# Altium schematic sheet 5V_12V_External.SchDoc
size A4; SheetNumber: 3
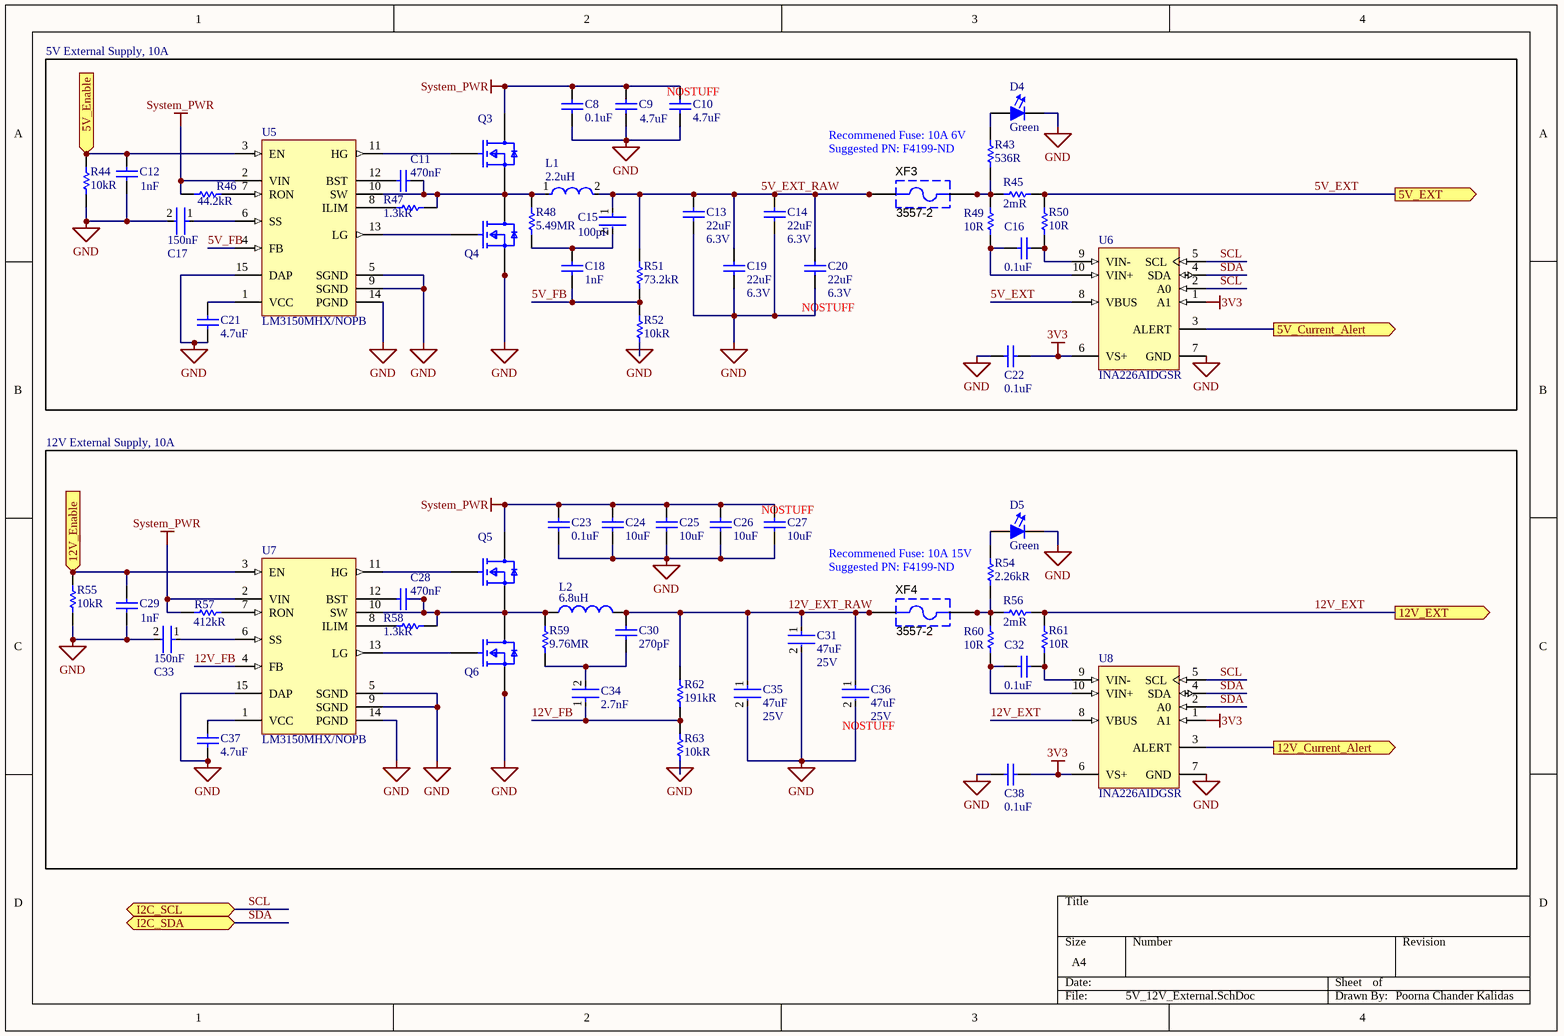
[diagram p0: 5V_12V_External.SchDoc]

## Parts
C8  Capacitance: 0.1uF  [FP-CL10-0_1-IPC_A]  (hidden comment: CL10B104JB8NNNC)
C9  Capacitance: 4.7uF  [CAPC3216X18N]  (hidden comment: CL31B475KBHNNNE)
C10  Capacitance: 4.7uF  [CAPC3216X18N]  (hidden comment: CL31B475KBHNNNE)
C11  value 470nF  [CAPC1608N(0603")]  (hidden comment: 470nF, 50V, 10%, 0603, Ceramic, SMD)
C12  Capacitance: 1nF  [CAPC1608X90X30ML10T20]  (hidden comment: CL10B102KB8NNNC)
C13  Capacitance: 22uF  Voltage Rating (DC): 6.3V  [CAPC1608X90X35ML10T15]  (hidden comment: GRM188R60J226MEA0D)
C14  Capacitance: 22uF  Voltage Rating (DC): 6.3V  [CAPC1608X90X35ML10T15]  (hidden comment: GRM188R60J226MEA0D)
C15  Capacitance: 100pF  [FP-CL10-IPC_A]  (hidden comment: CL10C101FB8NNNC)
C16  Capacitance: 0.1uF  [FP-CL10-0_1-IPC_A]  (hidden comment: CL10B104JB8NNNC)
C17  Capacitance: 150nF  [FP-CL21-IPC_A]  (hidden comment: CL21B154KBFNNNG)
C18  Capacitance: 1nF  [CAPC1608X90X30ML10T20]  (hidden comment: CL10B102KB8NNNC)
C19  Capacitance: 22uF  Voltage Rating (DC): 6.3V  [CAPC1608X90X35ML10T15]  (hidden comment: GRM188R60J226MEA0D)
C20  Capacitance: 22uF  Voltage Rating (DC): 6.3V  [CAPC1608X90X35ML10T15]  (hidden comment: GRM188R60J226MEA0D)
C21  Capacitance: 4.7uF  [CAPC3216X18N]  (hidden comment: CL31B475KBHNNNE)
C22  Capacitance: 0.1uF  [FP-CL10-0_1-IPC_A]  (hidden comment: CL10B104JB8NNNC)
C23  Capacitance: 0.1uF  [FP-CL10-0_1-IPC_A]  (hidden comment: CL10B104JB8NNNC)
C24  Capacitance: 10uF  [CAPC3216X180X50ML20T30]  (hidden comment: CL31B106KBHNNNE)
C25  Capacitance: 10uF  [CAPC3216X180X50ML20T30]  (hidden comment: CL31B106KBHNNNE)
C26  Capacitance: 10uF  [CAPC3216X180X50ML20T30]  (hidden comment: CL31B106KBHNNNE)
C27  Capacitance: 10uF  [CAPC3216X180X50ML20T30]  (hidden comment: CL31B106KBHNNNE)
C28  value 470nF  [CAPC1608N(0603")]  (hidden comment: 470nF, 50V, 10%, 0603, Ceramic, SMD)
C29  Capacitance: 1nF  [CAPC1608X90X30ML10T20]  (hidden comment: CL10B102KB8NNNC)
C30  Capacitance: 270pF  [CAPC1608X90X35ML10T15]  (hidden comment: GRM1885C2A271JA01D)
C31  Capacitance: 47uF  Voltage: 25V  [FP-C3216-160-IPC_A]  (hidden comment: C3216X5R1E476M160AC)
C32  Capacitance: 0.1uF  [FP-CL10-0_1-IPC_A]  (hidden comment: CL10B104JB8NNNC)
C33  Capacitance: 150nF  [FP-CL21-IPC_A]  (hidden comment: CL21B154KBFNNNG)
C34  Capacitance: 2.7nF  [FP-CGA4J-IPC_A]  (hidden comment: CGA4C2C0G1H272J060AA)
C35  Capacitance: 47uF  Voltage: 25V  [FP-C3216-160-IPC_A]  (hidden comment: C3216X5R1E476M160AC)
C36  Capacitance: 47uF  Voltage: 25V  [FP-C3216-160-IPC_A]  (hidden comment: C3216X5R1E476M160AC)
C37  Capacitance: 4.7uF  [CAPC3216X18N]  (hidden comment: CL31B475KBHNNNE)
C38  Capacitance: 0.1uF  [FP-CL10-0_1-IPC_A]  (hidden comment: CL10B104JB8NNNC)
D4  Color: Green  [FP-LB_Q39E-MFG]  (hidden comment: LT Q39G-Q1OO-25-1)
D5  Color: Green  [FP-LB_Q39E-MFG]  (hidden comment: LT Q39G-Q1OO-25-1)
L1  Inductance: 2.2uH  [FP-SRP1270-MFG]  (hidden comment: SRP1270-2R2M)
L2  Inductance: 6.8uH  [PG0936.682NL-Footprint-1]  (hidden comment: PG0936.682NL)
Q3  IPC50N04S5L5R5ATMA1  [FP-DQJ0008A-MFG]  (value not drawn)
Q4  IPC50N04S5L5R5ATMA1  [FP-DQJ0008A-MFG]  (value not drawn)
Q5  IPC50N04S5L5R5ATMA1  [FP-DQJ0008A-MFG]  (value not drawn)
Q6  IPC50N04S5L5R5ATMA1  [FP-DQJ0008A-MFG]  (value not drawn)
R43  Resistance: 536R  [RESC1608X55X30ML15T15]  (hidden comment: ERJ-3EKF5360V)
R44  Resistance: 10kR  [RESC1608X55X25ML10T15]  (hidden comment: RC0603FR-0710KL)
R45  Resistance: 2mR  [RESC2716X08N]  (hidden comment: CSR1206-0R002F1)
R46  Resistance: 44.2kR  [RESC1609X50X30ML10T20]  (hidden comment: CRCW060344K2FKEA)
R47  Resistance: 1.3kR  [RESC1609X50X30ML10T20]  (hidden comment: CRCW06031K30FKEA)
R48  Resistance: 5.49MR  [RESC1608N(0603")]  (hidden comment: CRCW06035M49FKEA)
R49  Resistance: 10R  [FP-ERJ3EK-IPC_A]  (hidden comment: ERJ3EKF10R0V)
R50  Resistance: 10R  [FP-ERJ3EK-IPC_A]  (hidden comment: ERJ3EKF10R0V)
R51  Resistance: 73.2kR  [RESC1608X55X30ML15T15]  (hidden comment: ERJ-3EKF7322V)
R52  Resistance: 10kR  [RESC1608X55X25ML10T15]  (hidden comment: RC0603FR-0710KL)
R54  Resistance: 2.26kR  [RESC0603(1608)_M]  (hidden comment: RC0603FR-072K26L)
R55  Resistance: 10kR  [RESC1608X55X25ML10T15]  (hidden comment: RC0603FR-0710KL)
R56  Resistance: 2mR  [RESC2716X08N]  (hidden comment: CSR1206-0R002F1)
R57  Resistance: 412kR  [RESC1608X55X30ML15T15]  (hidden comment: ERJ-3EKF4123V)
R58  Resistance: 1.3kR  [RESC1609X50X30ML10T20]  (hidden comment: CRCW06031K30FKEA)
R59  Resistance: 9.76MR  [RESC0603(1608)_M]  (hidden comment: CRCW06039M76FKEA)
R60  Resistance: 10R  [FP-ERJ3EK-IPC_A]  (hidden comment: ERJ3EKF10R0V)
R61  Resistance: 10R  [FP-ERJ3EK-IPC_A]  (hidden comment: ERJ3EKF10R0V)
R62  Resistance: 191kR  [RESC1608X55X30ML15T15]  (hidden comment: ERJ-3EKF1913V)
R63  Resistance: 10kR  [RESC1608X55X25ML10T15]  (hidden comment: RC0603FR-0710KL)
U5  LM3150MHX/NOPB  [PWP0014A_M]
U6  INA226AIDGSR  [DGS0010A_M]
U7  LM3150MHX/NOPB  [PWP0014A_M]
U8  INA226AIDGSR  [DGS0010A_M]
XF3  3557-2  [KSTN-3557-2]
XF4  3557-2  [KSTN-3557-2]

## Ports
5V_Current_Alert (out), 5V_Enable (in), 5V_EXT (out), 12V_Current_Alert (out), 12V_Enable (in), 12V_EXT (out), I2C_SCL (bidir), I2C_SDA (bidir)

## Nets
3V3: C22.1 C38.1 U6.1(A1) U6.6(VS+) U8.1(A1) U8.6(VS+)
GND: C8.1 C9.2 C10.2 C12.1 C13.2 C14.2 C17.2 C19.2 C20.2 C21.1 C22.2 C23.1 C24.2 C25.2 C26.2 C27.2 C29.1 C31.2 C33.2 C35.2 C36.2 C37.1 C38.2 D4.1(Cathode) D5.1(Cathode) Q4.1(S) Q4.2(S) Q4.3(S) Q6.1(S) Q6.2(S) Q6.3(S) R44.1 R52.1 R55.1 R63.1 U5.5(SGND) U5.9(SGND) U5.14(PGND) U5.15(DAP) U6.7(GND) U7.5(SGND) U7.9(SGND) U7.14(PGND) U7.15(DAP) U8.7(GND)
System_PWR: C8.2 C9.1 C10.1 C23.2 C24.1 C25.1 C26.1 C27.1 Q3.5-6-7-8(D) Q5.5-6-7-8(D) R46.1 R57.2 U5.2(VIN) U7.2(VIN)
5V_Current_Alert: U6.3(ALERT) ; port 5V_Current_Alert
5V_Enable: C12.2 R44.2 U5.3(EN) ; port 5V_Enable
5V_EXT: R45.1 R50.1 U6.8(VBUS) ; port 5V_EXT
5V_EXT_RAW: C13.1 C14.1 C15.1 C19.1 C20.1 L1.2 R51.1 XF3.1 XF3.2
5V_FB: C18.1 R51.2 R52.2 U5.4(FB)
12V_Current_Alert: U8.3(ALERT) ; port 12V_Current_Alert
12V_Enable: C29.2 R55.2 U7.3(EN) ; port 12V_Enable
12V_EXT: R56.1 R61.1 U8.8(VBUS) ; port 12V_EXT
12V_EXT_RAW: C30.1 C31.1 C35.1 C36.1 L2.2 R62.1 XF4.1 XF4.2
12V_FB: C34.1 R62.2 R63.2 U7.4(FB)
SCL: U6.2(A0) U6.5(SCL) U8.5(SCL) ; port I2C_SCL
SDA: U6.4(SDA) U8.2(A0) U8.4(SDA) ; port I2C_SDA
NetC11_1: C11.1(Anode) L1.1 Q3.1(S) Q3.2(S) Q3.3(S) Q4.5-6-7-8(D) R47.2 R48.1 U5.10(SW)
NetC11_2: C11.2(Cathode) U5.12(BST)
NetC15_2: C15.2 C18.2 R48.2
NetC16_1: C16.1 R50.2 U6.9(VIN-)
NetC16_2: C16.2 R49.2 U6.10(VIN+)
NetC17_1: C17.1 U5.6(SS)
NetC21_2: C21.2 U5.1(VCC)
NetC28_1: C28.1(Anode) L2.1 Q5.1(S) Q5.2(S) Q5.3(S) Q6.5-6-7-8(D) R58.2 R59.2 U7.10(SW)
NetC28_2: C28.2(Cathode) U7.12(BST)
NetC30_2: C30.2 C34.2 R59.1
NetC32_1: C32.1 R61.2 U8.9(VIN-)
NetC32_2: C32.2 R60.2 U8.10(VIN+)
NetC33_1: C33.1 U7.6(SS)
NetC37_2: C37.2 U7.1(VCC)
NetD4_2: D4.2(Anode) R43.2
NetD5_2: D5.2(Anode) R54.2
NetQ3_4: Q3.4(G) U5.11(HG)
NetQ4_4: Q4.4(G) U5.13(LG)
NetQ5_4: Q5.4(G) U7.11(HG)
NetQ6_4: Q6.4(G) U7.13(LG)
NetR43_1: R43.1 R45.2 R49.1 XF3.3 XF3.4
NetR46_2: R46.2 U5.7(RON)
NetR47_1: R47.1 U5.8(ILIM)
NetR54_1: R54.1 R56.2 R60.1 XF4.3 XF4.4
NetR57_1: R57.1 U7.7(RON)
NetR58_1: R58.1 U7.8(ILIM)

## Notes on the sheet
- 5V External Supply, 10A
- (near C10) NOSTUFF
- (near R43) Recommened Fuse: 10A 6V
  Suggested PN: F4199-ND
- (near C20) NOSTUFF
- 12V External Supply, 10A
- (near C27) NOSTUFF
- (near R54) Recommened Fuse: 10A 15V
  Suggested PN: F4199-ND
- (near C36) NOSTUFF
- Poorna Chander Kalidas

## Library data of the parts
C8 C16 C22 C23 C32 C38 = CMP-00000-4: CAP CER 0.1UF 50V X7R 0603; Tolerance: 5%; Material: Ceramic; Case Code (Imperial): 0603; Mount: Surface Mount; Thickness: 0.035inch; Depth: 0.8mm; Packaging: Tape and Reel; Package Quantity: 1; Dielectric: X7R; Height: 0.8mm; Voltage: 50V; Radiation Hardening: No; Max Operating Temperature: 125°C; Voltage Rating: 50V; Case/Package: 0603; Min Operating Temperature: -55°C; Case Code (Metric): 1608; Length: 1.6mm; Contact Plating: Tin; Width: 0.031inch
C9 C10 C21 C37 = CMP-00019-1: Capacitor 4.7 uF 50 VDC PU=2000 ST, CL31B475KBHNNNE, Samsung; Dielectric: X7R; Voltage: 50V; Tolerance: 10%; Thickness: 0.071inch; Case Code (Metric): 3216; Mount: Surface Mount; Packaging: Tape and Reel; Depth: 1.6mm; Package Quantity: 1; Voltage Rating: 50V; Radiation Hardening: No; Max Operating Temperature: 125°C; Min Operating Temperature: -55°C; Width: 0.063inch; Case/Package: 1206; Case Code (Imperial): 1206; Length: 3.2mm; Height: 1.6mm
C11 C28 = CMP-006-0048-1: Capacitor, Ceramic, 50V, 10%, 0603 SMD, X7R; Made By: Ashwin Sira; Component Type: Standard; Publisher: AUVic; Design Item ID: 470nF, 50V, 10%, 0603, Ceramic, SMD; Date Created: 2016-06-25; Pin Count: 2; Source: AUVic_Schematic_Library_Capacitors.SchLib; PackageDescription: Chip Capacitor
C12 C18 C29 = CMP-00018-2: Cap Ceramic 0.001uF 50V X7R 10% Pad SMD 0603 125°C T/R; Tolerance: 10%; Case Code (Imperial): 0603; Packaging: Tape and Reel; Dielectric: X7R; Thickness: 0.035inch; Contact Plating: Tin; Min Operating Temperature: -55°C; Voltage Rating: 50V; Height: 0.8mm; Material: Ceramic; Width: 0.031inch; Max Operating Temperature: 125°C; Case/Package: 0603; Voltage Rating (DC): 50V; Case Code (Metric): 1608; Depth: 0.8mm; Radiation Hardening: No; Lead Free: Lead Free; Mount: Surface Mount; Voltage: 50V; Package Quantity: 1; Length: 1.6mm
C13 C14 C19 C20 = CMP-00025-2: MURATA - GRM188R60J226MEA0D - SMD Multilayer Ceramic Capacitor, 22 µF, 6.3 V, 0603 [1608 Metric], ± 20%, X5R, GRM Series; Lead Free: Lead Free; Length: 1.6mm; Depth: 0.8mm; Dielectric: X5R; Tolerance: 20%; Width: 0.8mm; Termination: SMD/SMT; REACH SVHC: No SVHC; Height: 0.8mm; Weight: 0.000222oz; Thickness: 0.039inch; Package Quantity: 4000; Mount: Surface Mount; Min Operating Temperature: -55°C; Case Code (Metric): 1608; Case Code (Imperial): 0603; Voltage Rating: 6.3V; Max Operating Temperature: 85°C; Case/Package: 0603; Packaging: Tape and Reel
C15 = CMP-00027-2: Ceramic capacitor SMD 0603 100 pF 50 V 1 %; Voltage Rating: 50V; Dielectric: C0G; Temperature Coefficient: 300ppm/°C; Tolerance: 1%; Radiation Hardening: No; Thickness: 0.035inch; Max Operating Temperature: 125°C; Voltage Rating (DC): 50V; Material: Ceramic; Min Operating Temperature: -55°C; Depth: 0.8mm; Voltage: 50V; Mount: Surface Mount; Case Code (Metric): 1608; Case Code (Imperial): 0603; Packaging: Tape and Reel; Case/Package: 0603; Height: 0.8mm; Package Quantity: 1; Width: 0.031inch; Length: 1.6mm
C17 C33 = CMP-00020-2: CAP CER 0.15UF 50V X7R 0805; Tolerance: 10%; Material: Ceramic; Case Code (Imperial): 0805; Dielectric: X7R; Package Quantity: 3000; Max Operating Temperature: 125°C; Length: 2mm; Voltage Rating: 50V; Thickness: 0.053inch; Mount: Surface Mount; Height: 1.25mm; Width: 0.049inch; Packaging: Tape and Reel; Voltage: 50V; Radiation Hardening: No; Case Code (Metric): 2012; Depth: 1.25mm; Min Operating Temperature: -55°C; Case/Package: 0805; Lead Free: Lead Free
C24-C27 = CMP-00004-2: Cap Ceramic 10uF 50V X7R 10% Pad SMD 1206 125°C T/R; Thickness: 0.071inch; Case/Package: 1206; Case Code (Metric): 3216; Case Code (Imperial): 1206; Voltage Rating: 50V; Length: 0.126inch; Max Operating Temperature: 125°C; Voltage Rating (DC): 50V; Dielectric: X7R; Lead Free: Lead Free; Min Operating Temperature: -55°C; Tolerance: 10%; Mount: Surface Mount; Packaging: Tape and Reel; Width: 0.063inch
C30 = CMP-00053-2: CAP CER 270PF 100V C0G/NP0 0603; Material: Ceramic; Dielectric: C0G; Tolerance: 5%; Voltage Rating (DC): 100V; Mount: Surface Mount; Width: 0.8mm; Min Operating Temperature: -55°C; Packaging: Tape and Reel; Length: 1.6mm; Case Code (Imperial): 0603; Case/Package: 0603; Height: 0.8mm; Thickness: 0.035inch; Termination: SMD/SMT; Voltage Rating: 100V; Radiation Hardening: No; Package Quantity: 1; Lead Free: Lead Free; Max Operating Temperature: 125°C; Depth: 0.8mm; Case Code (Metric): 1608
C31 C35 C36 = CMP-00048-2: TDK - C3216X5R1E476M160AC - SMD Multilayer Ceramic Capacitor, 47 µF, 25 V, 1206 [3216 Metric], ± 20%, X5R, C Series; Composition: Ceramic; Depth: 1.6mm; Case Code (Metric): 3216; Case Code (Imperial): 1206; Package Quantity: 1; REACH SVHC: No SVHC; Min Operating Temperature: -55°C; Case/Package: 1206; Max Operating Temperature: 85°C; Voltage Rating (DC): 25V; Termination: SMD/SMT; Thickness: 1.6mm; Dielectric Material: Ceramic; Mount: Surface Mount; Width: 0.063inch; Weight: 0.000571oz; Voltage Rating: 25V; Lead Free: Lead Free; Height: 1.6mm; Tolerance: 20%; Length: 3.2mm; Dielectric: X5R; Packaging: Tape and Reel
C34 = CMP-00054-2: CAP CER 2700PF 50V C0G 0805; Tolerance: 5%; Height: 0.6mm; Width: 1.25mm; Length: 2mm; Mount: Surface Mount; Dielectric: C0G; Weight: 0.000194oz; Package Quantity: 1; Case/Package: 0805; Thickness: 0.03inch; Max Operating Temperature: 125°C; Case Code (Imperial): 0805; Voltage Rating (DC): 50V; Radiation Hardening: No; Composition: Ceramic; Min Operating Temperature: -55°C; Case Code (Metric): 2012; Termination: SMD/SMT; Ratings: AEC-Q200; Packaging: Tape and Reel; Depth: 1.25mm; Voltage Rating: 50V
D4 D5 = CMP-00064-3: LED GREEN DIFFUSED 0603 SMD; Dominant Wavelength: 530nm; Luminous Intensity: 280mcd; Lens Style: Diffused,Colorless,Rectangular; Number of LEDs: 1; Forward Voltage: 2.85V; Test Current: 5mA; Reverse Voltage: 5V; Forward Current: 15mA; Luminous Flux: 0.55lm; Radiation Hardening: No; Packaging: Tape and Reel; Mount: Surface Mount; Max Operating Temperature: 85°C; Number of Elements: 1; Number of Pins: 2; Min Operating Temperature: -40°C; Depth: 0.9mm; Case/Package: SMD/SMT; Length: 1.7mm
L1 = CMP-00024-1: BOURNS         SRP1270-2R2M             Surface Mount Power Inductor, SRP1270 Series, 2.2 H, 22 A, 40 A, Shielded, 4200 ohm; Current: 46A; DC Current: 22A; Inductance Tolerance: 20%; Core Material: Ferrite; DC Resistance (DCR): 4.2mR; Self Resonant Frequency: 25MHz; Saturation Current: 40A; Test Frequency: 100kHz; Number of Pins: 2; REACH SVHC: No SVHC; Packaging: Tape and Reel; Military Standard: Not; Depth: 13.7mm; Shielding: Shielded; Min Operating Temperature: -55°C; Height - Seated (Max): 0.276inch; Height: 7mm; Composition: Wirewound; Tolerance: 20%; Width: 13.7mm; Mount: Surface Mount; Termination: SMD/SMT; Case/Package: Nonstandard; Package Quantity: 400; Max Operating Temperature: 125°C; RMS Current (Irms): 22A; Length: 13.7mm; Current Rating: 22A; Max DC Current: 22A
L2 = CMP-00050-1: Inductor Power Shielded Wirewound 6.8uH/5.4uH 20% 100KHz Ferrite 18A 0.0035Ohm DCR Automotive; Current Rating: 21A; Saturation Current: 15A; DC Resistance (DCR): 3.5mR; Shielding: Unshielded; Packaging: Tray; Width: 0.657inch; Height - Seated (Max): 0.394inch; Composition: Wirewound; Max Operating Temperature: 130°C; Mount: Surface Mount; Length: 0.689inch; Min Operating Temperature: -40°C; Case/Package: Nonstandard; Tolerance: 20%
Q3-Q6 = CMP-00023-2: N-CHANNEL_30/40V; Rds On Max: 5.5mR; Max Dual Supply Voltage: 40V; Number of Levels: 1; Wire Gauge (Min): 18AWG; Wire Gauge (Max): 28AWG; Input Capacitance: 1.209nF; Number of Positions Per Level: 3; Max Power Dissipation: 42W; Color: Grey; Plating: Steel; Continuous Drain Current (ID): 50A; Drain to Source Voltage (Vdss): 40V; Max Operating Temperature: 175°C; Halogen Free: Halogen Free; Lead Free: Contains Lead; Housing Material: Nylon; Number of Pins: 8; Contact Plating: Tin; Min Operating Temperature: -55°C; Packaging: Cut Tape; Mount: Surface Mount,Through Hole
R43 = CMP-00071-2: SMD Chip Resistor, 0603 [1608 Metric], 536 ohm, ERJ3EK Series, 75 V, Thick Film, 100 mW; Power Rating: 100mW; Voltage Rating: 75V; Voltage Rating (DC): 50V; Tolerance: 1%; Temperature Coefficient: 100ppm/°C; Contact Plating: Tin; Package Quantity: 1; Case Code (Metric): 1608; Length: 1.6mm; Max Operating Temperature: 155°C; Mount: Surface Mount; Features: Automotive AEC-Q200; Width: 0.8mm; Lead Free: Lead Free; Number of Terminations: 2; Case/Package: 0603; Case Code (Imperial): 0603; Packaging: Tape and Reel; Height: 0.022inch; Military Standard: Not; Min Operating Temperature: -55°C; REACH SVHC: No SVHC; Max Power Dissipation: 100mW; Termination: SMD/SMT; Depth: 0.8mm; Composition: Thick Film
R44 R52 R55 R63 = CMP-00037-2: Res General Purpose Thick Film 0603 10K Ohm 1% 1/10W ±100ppm/°C Molded SMD Paper T/R; Power Rating: 100mW; Voltage Rating (DC): 50V; Voltage Rating: 75V; Case/Package: 0603; Weight: 7.1E-05oz; Case Code (Imperial): 0603; Composition: Thick Film; Depth: 0.8mm; Min Operating Temperature: -55°C; Width: 0.8mm; Height: 0.45mm; Military Standard: Not; Packaging: Tape and Reel; Termination: SMD/SMT; Lead Free: Lead Free; Temperature Coefficient: 100ppm/°C; Number of Pins: 2; Max Operating Temperature: 155°C; Lead Pitch: 0.3mm; REACH SVHC: No SVHC; Case Code (Metric): 1608; Tolerance: 1%; Length: 1.6mm
R45 R56 = CMP-00031-1: RES 0.002 OHM 1W 1% 1206; Temperature Coefficient: 50ppm/°C; Number of Terminations: 2; Composition: Metal Element; Case Code (Metric): 3216; Min Operating Temperature: -55°C; Length: 0.126inch; Tolerance: 1%; Packaging: Tape and Reel; Max Power Dissipation: 1W; Width: 0.063inch; Package Quantity: 1; Max Operating Temperature: 170°C; Height: 0.024inch; Case/Package: 1206; Case Code (Imperial): 1206
R46 = CMP-00021-2: Res Thick Film 0603 44.2K Ohm 1% 0.1W(1/10W) ±100ppm/C Pad SMD Automotive T/R; Max Power Dissipation: 100mW; Voltage Rating: 75V; Temperature Coefficient: 100ppm/°C; Width: 0.85mm; Case Code (Metric): 1608; Radiation Hardening: No; Military Standard: Not; Depth: 0.85mm; Tolerance: 1%; Min Operating Temperature: -55°C; Case Code (Imperial): 0603; Contact Plating: Tin; REACH SVHC: Unknown; Termination: SMD/SMT; Power Rating: 100mW; Composition: Thick Film; Lead Free: Lead Free; Weight: 7.1E-05oz; Max Operating Temperature: 155°C; Height: 0.45mm; Features: Automotive AEC-Q200; Package Quantity: 10; Packaging: Tape and Reel; Number of Terminations: 2; Length: 1.55mm; Voltage Rating (DC): 75V; Case/Package: 0603
R47 R58 = CMP-00026-2: Res Thick Film 0603 1.3K Ohm 1% 1/10W 100ppm/C Molded SMD SMD Paper T/R; Voltage Rating (DC): 75V; Power Rating: 100mW; Temperature Coefficient: 100ppm/°C; Depth: 0.85mm; Military Standard: Not; Composition: Thick Film; Case Code (Metric): 1608; Lead Free: Lead Free; Case/Package: 0603; Packaging: Tape and Reel; Max Operating Temperature: 155°C; Voltage Rating: 75V; Tolerance: 1%; Height: 0.45mm; Package Quantity: 5000; Case Code (Imperial): 0603; Width: 0.85mm; Length: 1.55mm; REACH SVHC: Unknown; Termination: SMD/SMT; Radiation Hardening: No; Contact Plating: Tin; Weight: 7.1E-05oz; Number of Pins: 2; Min Operating Temperature: -55°C
R48 = CMP-00028-1: RES SMD 5.49M OHM 1% 1/10W 0603; Voltage Rating: 75V; Temperature Coefficient: 100ppm/°C; Max Power Dissipation: 100mW; Termination: SMD/SMT; Depth: 0.85mm; Composition: Thick Film; Max Operating Temperature: 155°C; Package Quantity: 10; Contact Plating: Tin; Width: 0.033inch; Lead Free: Lead Free; Length: 1.55mm; Number of Terminations: 2; Min Operating Temperature: -55°C; Weight: 7.1E-05oz; Case Code (Imperial): 0603; REACH SVHC: Unknown; Number of Pins: 2; Military Standard: Not; Power Rating: 100mW; Features: Automotive AEC-Q200; Tolerance: 1%; Voltage Rating (DC): 75V; Height: 0.02inch; Packaging: Tape and Reel; Case/Package: 0603; Radiation Hardening: No; Case Code (Metric): 1608
R49 R50 R60 R61 = CMP-00034-3: PANASONIC - ERJ3EKF10R0V - SMD Chip Resistor, 0603 [1608 Metric], 10 ohm, ERJ3EK Series, 75 V, Thick Film, 100 mW; Temperature Coefficient: 100ppm/°C; Tolerance: 1%; Max Power Dissipation: 100mW; Voltage Rating (DC): 75V; Package Quantity: 5000; Case Code (Imperial): 0603; Military Standard: Not; Depth: 0.8mm; Number of Terminations: 2; Working Voltage: 75V; Min Operating Temperature: -55°C; Width: 0.8mm; Composition: Thick Film; Packaging: Tape and Reel; Power Rating: 100mW; REACH SVHC: No SVHC; Max Operating Temperature: 155°C; Case Code (Metric): 1608; Features: Automotive AEC-Q200; Case/Package: 0603; Length: 1.6mm; Number of Pins: 2; Lead Free: Lead Free; Height: 0.45mm; Voltage Rating: 75V; Contact Plating: Tin; Termination: SMD/SMT; Mount: Surface Mount; Radiation Hardening: No
R51 = CMP-00029-2: Res Thick Film 0603 73.2K Ohm 1% 0.1W(1/10W) ±100ppm/C Pad SMD Automotive T/R; Max Power Dissipation: 100mW; Voltage Rating (DC): 50V; Temperature Coefficient: 100ppm/°C; Voltage Rating: 75V; Packaging: Tape and Reel; REACH SVHC: No SVHC; Case Code (Imperial): 0603; Mount: Surface Mount; Height: 0.022inch; Military Standard: Not; Features: Automotive AEC-Q200; Power Rating: 100mW; Width: 0.031inch; Termination: SMD/SMT; Number of Terminations: 2; Composition: Thick Film; Length: 1.6mm; Depth: 0.8mm; Min Operating Temperature: -55°C; Package Quantity: 1; Max Operating Temperature: 155°C; Case/Package: 0603; Case Code (Metric): 1608; Tolerance: 1%; Radiation Hardening: No; Contact Plating: Tin; Lead Free: Lead Free
R54 = CMP-00074-2: RES SMD 2.26K OHM 1% 1/10W 0603; Temperature Coefficient: 100ppm/°C; Voltage Rating (DC): 50V; Max Power Dissipation: 100mW; Min Operating Temperature: -55°C; Length: 1.6mm; Military Standard: Not; Lead Free: Lead Free; Composition: Thick Film; Termination: SMD/SMT; Case Code (Metric): 1608; Case/Package: 0603; Tolerance: 1%; Package Quantity: 1; Features: Moisture Resistant; Height: 0.022inch; Max Operating Temperature: 155°C; Depth: 0.8mm; Number of Terminations: 2; Voltage Rating: 50V; Width: 0.8mm; Power Rating: 100mW; Case Code (Imperial): 0603; Packaging: Tape and Reel
R57 = CMP-00056-3: GLOVE, POLYAMIDE, L/FREE, PU, SIZE 6 - More Details; Temperature Coefficient: 100ppm/°C; Power Rating: 100mW; Voltage Rating (DC): 75V; Tolerance: 1%; Width: 0.8mm; REACH SVHC: No SVHC; Package Quantity: 1; Min Operating Temperature: -55°C; Weight: 7.1E-05oz; Voltage Rating: 75V; Features: Automotive AEC-Q200; Packaging: Tape and Reel; Radiation Hardening: No; Lead Free: Contains Lead; Composition: Thick Film; Max Operating Temperature: 155°C; Number of Terminations: 2; Mount: Surface Mount; Military Standard: Not; Length: 1.6mm; Case Code (Metric): 1608; Height: 0.45mm; Contact Plating: Tin; Termination: SMD/SMT; Max Power Dissipation: 100mW; Depth: 0.8mm; Case Code (Imperial): 0603; Case/Package: 0603
R59 = CMP-00052-2: RES SMD 9.76M OHM 1% 1/10W 0603; Max Power Dissipation: 100mW; Temperature Coefficient: 100ppm/°C; Voltage Rating: 75V; Tolerance: 1%; Radiation Hardening: No; Case/Package: 0603; Power Rating: 100mW; Height: 0.02inch; Number of Pins: 2; Military Standard: Not; Max Operating Temperature: 155°C; Composition: Thick Film; Termination: SMD/SMT; Depth: 0.85mm; Number of Terminations: 2; Contact Plating: Tin; Min Operating Temperature: -55°C; Features: Automotive AEC-Q200; Width: 0.033inch; Case Code (Imperial): 0603; Packaging: Tape and Reel; REACH SVHC: Unknown; Weight: 7.1E-05oz; Voltage Rating (DC): 75V; Package Quantity: 10; Length: 1.55mm; Case Code (Metric): 1608; Lead Free: Lead Free
R62 = CMP-00055-2: RES, THICK FILM, 191KOHM, 0.1W, 0603; Voltage Rating: 75V; Power Rating: 100mW; Voltage Rating (DC): 50V; Tolerance: 1%; Temperature Coefficient: 100ppm/°C; Case Code (Metric): 1608; Mount: Surface Mount; REACH SVHC: No SVHC; Min Operating Temperature: -55°C; Number of Terminations: 2; Composition: Thick Film; Termination: SMD/SMT; Max Power Dissipation: 100mW; Military Standard: Not; Case/Package: 0603; Depth: 0.8mm; Contact Plating: Tin; Max Operating Temperature: 155°C; Lead Free: Contains Lead; Height: 0.45mm; Case Code (Imperial): 0603; Length: 1.6mm; Width: 0.8mm; Package Quantity: 1; Packaging: Tape and Reel; Features: Automotive AEC-Q200
U5 U7 = CMP-00012-1: IC REG CTRLR BUCK 14TSSOP; Max Supply Voltage: 42V; Quiescent Current: 3.5mA; Max Duty Cycle: 96%; Duty Cycle: 95%; Max Frequency: 1MHz; Output Voltage: 600mV; Min Supply Voltage: 6V; Output Current: 12A; Number of Outputs: 1; Lead Free: Lead Free; Min Operating Temperature: -40°C; REACH SVHC: No SVHC; Package Quantity: 2500; Max Operating Temperature: 125°C; Switching Frequency: 1MHz; Radiation Hardening: No; Features: UVLO; Case/Package: TSSOP; Contact Plating: Tin,Matte; Packaging: Tape and Reel; Number of Pins: 14; Mount: Surface Mount
U6 U8 = CMP-00032-1: Bi Directional Current and Power Monitor 10-Pin VSSOP T/R; Nominal Supply Current: 330uA; Common Mode Rejection Ratio: 140dB; Output Current: 10mA; Accuracy: 0.02%; Input Bias Current: 10uA; Input Offset Voltage (Vos): 2.5uV; Min Supply Voltage: 2.7V; Max Supply Voltage: 5.5V; Mount: Surface Mount; Case/Package: VSSOP; Contact Plating: Gold; Radiation Hardening: No; Packaging: Tape and Reel; Package Quantity: 1; Max Operating Temperature: 125°C; Lead Free: Lead Free; Number of Pins: 10; Min Operating Temperature: -40°C; REACH SVHC: No SVHC
XF3 XF4 = CMP-00030-4: Fuse Holder; Auto; 2 in1 Blade; THM; 1 Fuse; Vertical; 30 Amps; Current Rating: 20A; Voltage Rating (AC): 500V; Number of Poles: 1; Illumination Type: Illuminated; Fuse Type: Automotive; REACH SVHC: No SVHC; Lead Free: Lead Free; Max Operating Temperature: 145°C; Fuse Current: 20A; Min Operating Temperature: -50°C; Voltage: 500V; Contact Material: Brass; Orientation: Vertical; Package Quantity: 1; Depth: 6.8mm; Flammability Rating: UL94 V-0; Color: Black; Contact Plating: Tin; Termination: PC Pin; Material: Brass,Tin,Nylon; Number of Circuits: 1; Mount: Vertical,PCB; Length: 19.8mm